# Altium schematic sheet blue_pill.SchDoc
size 393 x 304 mm; Revision: 6; SheetNumber: 1; SheetTotal: 1
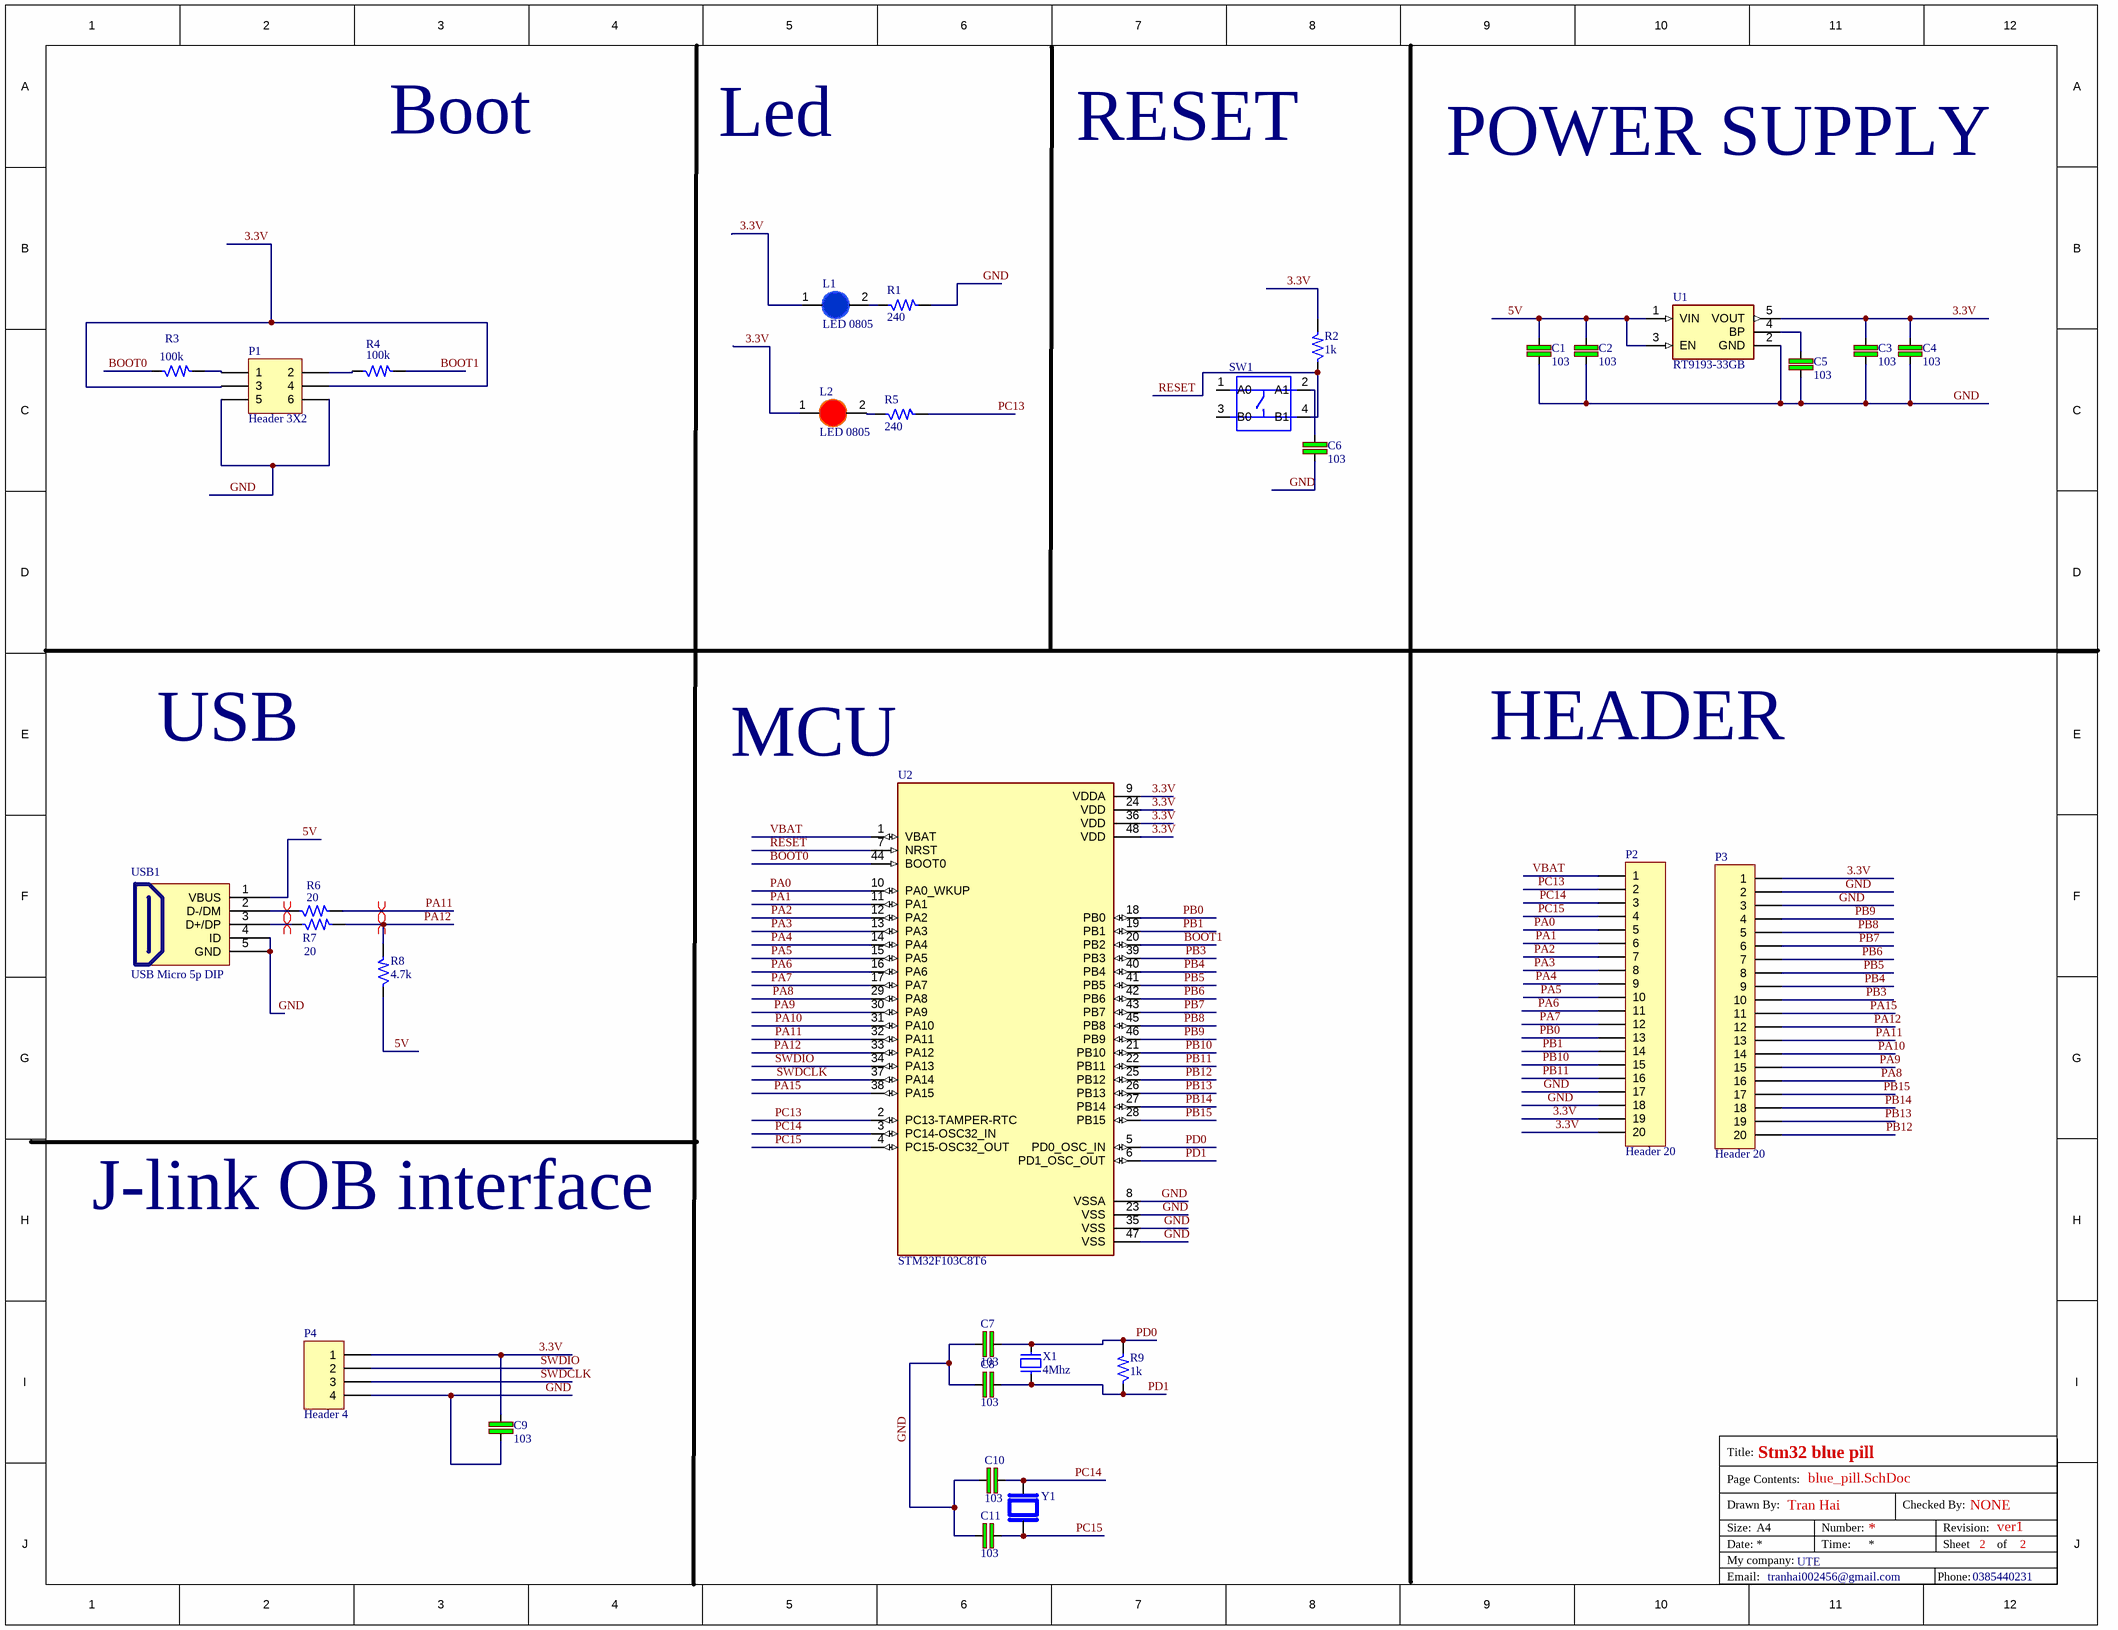
[diagram p0: blue_pill.SchDoc]

## Parts
C1  103  [C-0805]
C2  103  [C-0805]
C3  103  [C-0805]
C4  103  [C-0805]
C5  103  [C-0805]
C6  103  [C-0805]
C7  103  [C-0805]
C8  103  [C-0805]
C9  103  [C-0805]
C10  103  [C-0805]
C11  103  [C-0805]
L1  LED 0805  [LED-0805-Blue]
L2  LED 0805  [LED-0805-Red]
P1  Header 3X2  [HDR2X3]
P2  Header 20  [HDR1X20]
P3  Header 20  [HDR1X20]
P4  Header 4  [HDR1X4]
R1  240  [SM-1206]
R2  1k  [SM-1206]
R3  100k  [SM-1206]
R4  100k  [SM-1206]
R5  240  [SM-1206]
R6  20  [SM-1206]
R7  20  [SM-1206]
R8  4.7k  [SM-1206]
R9  1k  [SM-1206]
SW1  SMD-BUTTON(4P-5.2X5.2X1.5MM-SKQGAKE010)  [SW4-SMD-5.2X5.2X1.5MM]  (value not drawn)
U1  RT9193-33GB  [SOT94P279X129-5N]
U2  STM32F103C8T6  [QFP50P900X900X160-48N]
USB1  USB Micro 5p DIP  [USB Micro 5p DIP]
X1  4Mhz  [XT2]
Y1  ABS07-32.768KHZ-T  [XTAL_ABS07-32.768KHZ-T]  (value not drawn)

## Nets
3.3V: C3.2 C4.2 C9.2 L1.1(A) L2.1(A) P1.3 P1.4 P2.19 P2.20 P3.1 P4.1 R2.2 U1.5(VOUT) U2.9(VDDA) U2.24(VDD) U2.36(VDD) U2.48(VDD)
5V: C1.2 C2.2 R8.1 U1.1(VIN) U1.3(EN) USB1.1(VBUS)
BOOT0: R3.1 U2.44(BOOT0)
BOOT1: R4.2 U2.20(PB2)
GND: C1.1 C2.1 C3.1 C4.1 C5.1 C6.1 C7.1 C8.1 C9.1 C10.1 C11.1 P1.5 P1.6 P2.17 P2.18 P3.2 P3.3 P4.4 R1.2 U1.2(GND) U2.8(VSSA) U2.23(VSS) U2.35(VSS) U2.47(VSS) USB1.4(ID) USB1.5(GND)
PA0: P2.5 U2.10(PA0_WKUP)
PA1: P2.6 U2.11(PA1)
PA2: P2.7 U2.12(PA2)
PA3: P2.8 U2.13(PA3)
PA4: P2.9 U2.14(PA4)
PA5: P2.10 U2.15(PA5)
PA6: P2.11 U2.16(PA6)
PA7: P2.12 U2.17(PA7)
PA8: P3.16 U2.29(PA8)
PA9: P3.15 U2.30(PA9)
PA10: P3.14 U2.31(PA10)
PA11: P3.13 R6.2 U2.32(PA11)
PA12: P3.12 R7.2 R8.2 U2.33(PA12)
PA15: P3.11 U2.38(PA15)
PB0: P2.13 U2.18(PB0)
PB1: P2.14 U2.19(PB1)
PB3: P3.10 U2.39(PB3)
PB4: P3.9 U2.40(PB4)
PB5: P3.8 U2.41(PB5)
PB6: P3.7 U2.42(PB6)
PB7: P3.6 U2.43(PB7)
PB8: P3.5 U2.45(PB8)
PB9: P3.4 U2.46(PB9)
PB10: P2.15 U2.21(PB10)
PB11: P2.16 U2.22(PB11)
PB12: P3.20 U2.25(PB12)
PB13: P3.19 U2.26(PB13)
PB14: P3.18 U2.27(PB14)
PB15: P3.17 U2.28(PB15)
PC13: P2.2 R5.2 U2.2(PC13-TAMPER-RTC)
PC14: C10.2 P2.3 U2.3(PC14-OSC32_IN) Y1.2
PC15: C11.2 P2.4 U2.4(PC15-OSC32_OUT) Y1.1
PD0: C7.2 R9.2 U2.5(PD0_OSC_IN) X1.1
PD1: C8.2 R9.1 U2.6(PD1_OSC_OUT) X1.2
RESET: R2.1 SW1.4(B1) U2.7(NRST)
SWDCLK: P4.3 U2.37(PA14)
SWDIO: P4.2 U2.34(PA13)
VBAT: P2.1 U2.1(VBAT)
NetC5_2: C5.2 U1.4(BP)
NetC6_2: C6.2 SW1.2(A1)
NetL1_2: L1.2(K) R1.1
NetL2_2: L2.2(K) R5.1
NetP1_1: P1.1 R3.2
NetP1_2: P1.2 R4.1
NetR6_1: R6.1 USB1.2(D-/DM)
NetR7_1: R7.1 USB1.3(D+/DP)

Not connected (* = marked no-connect by the designer): SW1 1(A0) 3(B0)

## Layout directives
differential pair: NetR6_1, NetR7_1, PA11, PA12

## Notes on the sheet
- Boot
- Led
- RESET
- POWER SUPPLY
- USB
- MCU
- HEADER
- J-link OB interface
- Title:
- Stm32 blue pill
- Drawn By:
- Page Contents:
- Tran Hai
- Checked By:
- NONE
- Size:
- Date:
- My company:
- Email:
- A4
- tranhai002456@gmail.com
- UTE
- Number:
- Time:
- Phone:
- Revision:
- Sheet
- 0385440231
- 2
- ver1
- of
- DWG. NO.
- REV.
- SHT.
- REVISION
- DESCRIPTION
- DATE
- APPROVED
- THIS DOCUMENT AND THE DATA DISCLOSED HEREIN OR HEREWITH IS THE PROPERTY OF ALTIUM LIMITED AND MAY BE FREELY DISTRIBUTED IN WHOLE. NO RIGHTS ARE RESERVED OR EXPRESS OR IMPLIED WARANTEE GIVEN.
- ENG:
- DSN:
- APPROVALS
- PROJECT
- DOCUMENT REVISION:
- DESIGN ITEM:
- CHK:
- BOM:
- REFERENCE DOCUMENTS
- PROJECT REVISION:
- TITLE
- FAB DWG:
- PCB DWG:
- ASSY DWG:
- SCALE:
- SIZE
- D
- CAGE CODE
- FILE NAME
- DWG NO.
- SHEET
- OF
- REV

## Library data of the parts
C1-C11 = C: Cap SMD; Value: 103
L1 = LED 0805 Xanh Duong: Dán; Don_Vi: Con; Ma_Hang: MH002327; Ten_Linh_Kien: LED 0805 Màu Xanh Dương (Blue); Ghi_Chu: *; Kieu_Chan: *; Chung_Loai: Dán
L2 = LED 0805 Do: Dán; Don_Vi: Con; Ma_Hang: MH000897; Ten_Linh_Kien: LED 0805 Màu Đỏ (Red); Ghi_Chu: *; Kieu_Chan: *; Chung_Loai: Dán
P1 = Header 3X2: Header, 3-Pin, Dual row; LatestRevisionDate: 17-Jul-2002; LatestRevisionNote: Re-released for DXP Platform.; Publisher: Altium Limited
P2 P3 = Header 20: Header, 20-Pin; LatestRevisionDate: 17-Jul-2002; LatestRevisionNote: Re-released for DXP Platform.; Publisher: Altium Limited
P4 = Header 4: Header, 4-Pin; LatestRevisionDate: 17-Jul-2002; LatestRevisionNote: Re-released for DXP Platform.; Publisher: Altium Limited
R1-R9 = R: Resistor 1/4W; Value: R1/4W - 1K
SW1 = SMD-BUTTON(4P-5.2X5.2X1.5MM-SKQGAKE010): Switch Tactile N.O. SPST Button Gull Wing 0.05A 12VDC 3.43N SMD T/R; MF: ALPS; SnapEDA_Link: https://www.snapeda.com/parts/SKQGAKE010/ALPS/view-part/51324/?ref=snap; MP: SKQGAKE010; Price: None; Package: None; Value: *; Availability: Unavailable
U1 = RT9193-33GB: Linear Voltage Regulator IC Positive Fixed 1 Output 300mA TSOT-23-5; MF: Richtek USA; SnapEDA_Link: https://www.snapeda.com/parts/RT9193-33GB/Richtek+USA+Inc./view-part/?ref=snap; Package: SOT-23-5 Richtek; MP: RT9193-33GB; Check_prices: https://www.snapeda.com/parts/RT9193-33GB/Richtek+USA+Inc./view-part/?ref=eda; Purchase-URL: https://pricing.snapeda.com/search/part/RT9193-33GB/?ref=eda; Digi-Key_Part_Number: 1028-1014-2-ND; Value: *
U2 = STM32F103C8T6: ARM® Cortex®-M3 STM32F1 Microcontroller IC 32-Bit 72MHz 64KB (64K x 8) FLASH 48-LQFP (7x7); MF: STMicroelectronics; SnapEDA_Link: https://www.snapeda.com/parts/STM32F103C8T6/STMicroelectronics/view-part/?ref=snap; Package: LQFP-48 STMicroelectronics; Value: *; MP: STM32F103C8T6; Check_prices: https://www.snapeda.com/parts/STM32F103C8T6/STMicroelectronics/view-part/?ref=eda
USB1 = USB Micro 5p DIP: USB Type B; Ten: MicroUSB MK5P DIP; Ma_Hang: MH005145
X1 = XT2: Crystal For all Crystal 2pin.; Value: 4Mhz
Y1 = ABS07-32.768KHZ-T: 32.768 kHz Â±20ppm Crystal 12.5pF 70 kOhms 2-SMD, No Lead; MF: Abracon; Availability: In Stock; SnapEDA_Link: https://www.snapeda.com/parts/ABS07-32.768KHZ-T/Abracon+LLC/view-part/?ref=snap; MP: ABS07-32.768KHZ-T; Price: None; Value: *; Check_prices: https://www.snapeda.com/parts/ABS07-32.768KHZ-T/Abracon+LLC/view-part/?ref=eda; Purchase-URL: https://pricing.snapeda.com/search/part/ABS07-32.768KHZ-T/?ref=eda; Package: SMD-2 Abracon LLC